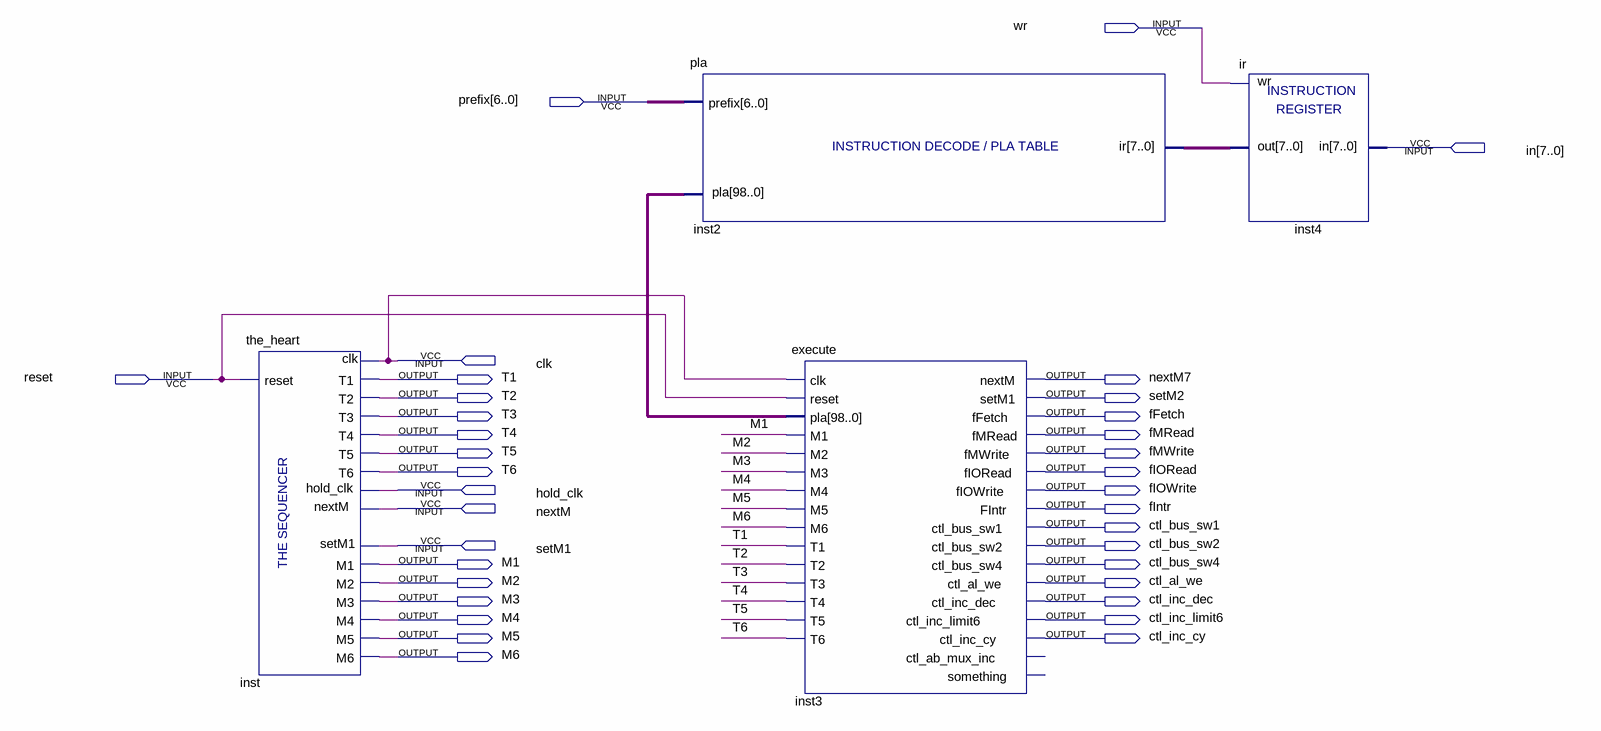
[diagram p0: schematic sheet]
// Quartus schematic test_control.bdf as structural Verilog: 4 symbols, 35 pins
module test_control (
  input  wr,
  input  [6:0] prefix,
  input  [7:0] in,
  input  clk,
  input  reset,
  input  hold_clk,
  input  nextM,
  input  setM1,
  output T1,
  output nextM7,
  output T2,
  output setM2,
  output T3,
  output fFetch,
  output T4,
  output fMRead,
  output T5,
  output fMWrite,
  output T6,
  output fIORead,
  output fIOWrite,
  output fIntr,
  output ctl_bus_sw1,
  output ctl_bus_sw2,
  output M1,
  output ctl_bus_sw4,
  output M2,
  output ctl_al_we,
  output M3,
  output ctl_inc_dec,
  output M4,
  output ctl_inc_limit6,
  output M5,
  output ctl_inc_cy,
  output M6
);

  wire [7:0] inst4_out;
  wire [98:0] inst2_pla;

  the_heart inst (
    .setM1(setM1), .clk(clk), .nextM(nextM), .reset(reset), .hold_clk(hold_clk), .M1(M1), .M2(M2), .M3(M3),
    .M4(M4), .M5(M5), .M6(M6), .T1(T1), .T2(T2), .T3(T3), .T4(T4), .T5(T5), .T6(T6));
  pla inst2 (.ir(inst4_out), .prefix(prefix), .pla(inst2_pla));
  execute inst3 (
    .clk(clk), .reset(reset), .pla(inst2_pla), .M1(M1), .M2(M2), .M3(M3), .M4(M4), .M5(M5), .M6(M6), .T1(T1),
    .T2(T2), .T3(T3), .T4(T4), .T5(T5), .T6(T6), .nextM(nextM7), .setM1(setM2), .fFetch(fFetch),
    .fMRead(fMRead), .fMWrite(fMWrite), .fIORead(fIORead), .fIOWrite(fIOWrite), .FIntr(fIntr),
    .ctl_bus_sw1(ctl_bus_sw1), .ctl_bus_sw2(ctl_bus_sw2), .ctl_bus_sw4(ctl_bus_sw4), .ctl_al_we(ctl_al_we),
    .ctl_inc_dec(ctl_inc_dec), .ctl_inc_limit6(ctl_inc_limit6), .ctl_inc_cy(ctl_inc_cy));  // open: ctl_ab_mux_inc, something
  ir inst4 (.in(in), .wr(wr), .out(inst4_out));
endmodule
